# Altium project ORCS4.PrjPcb
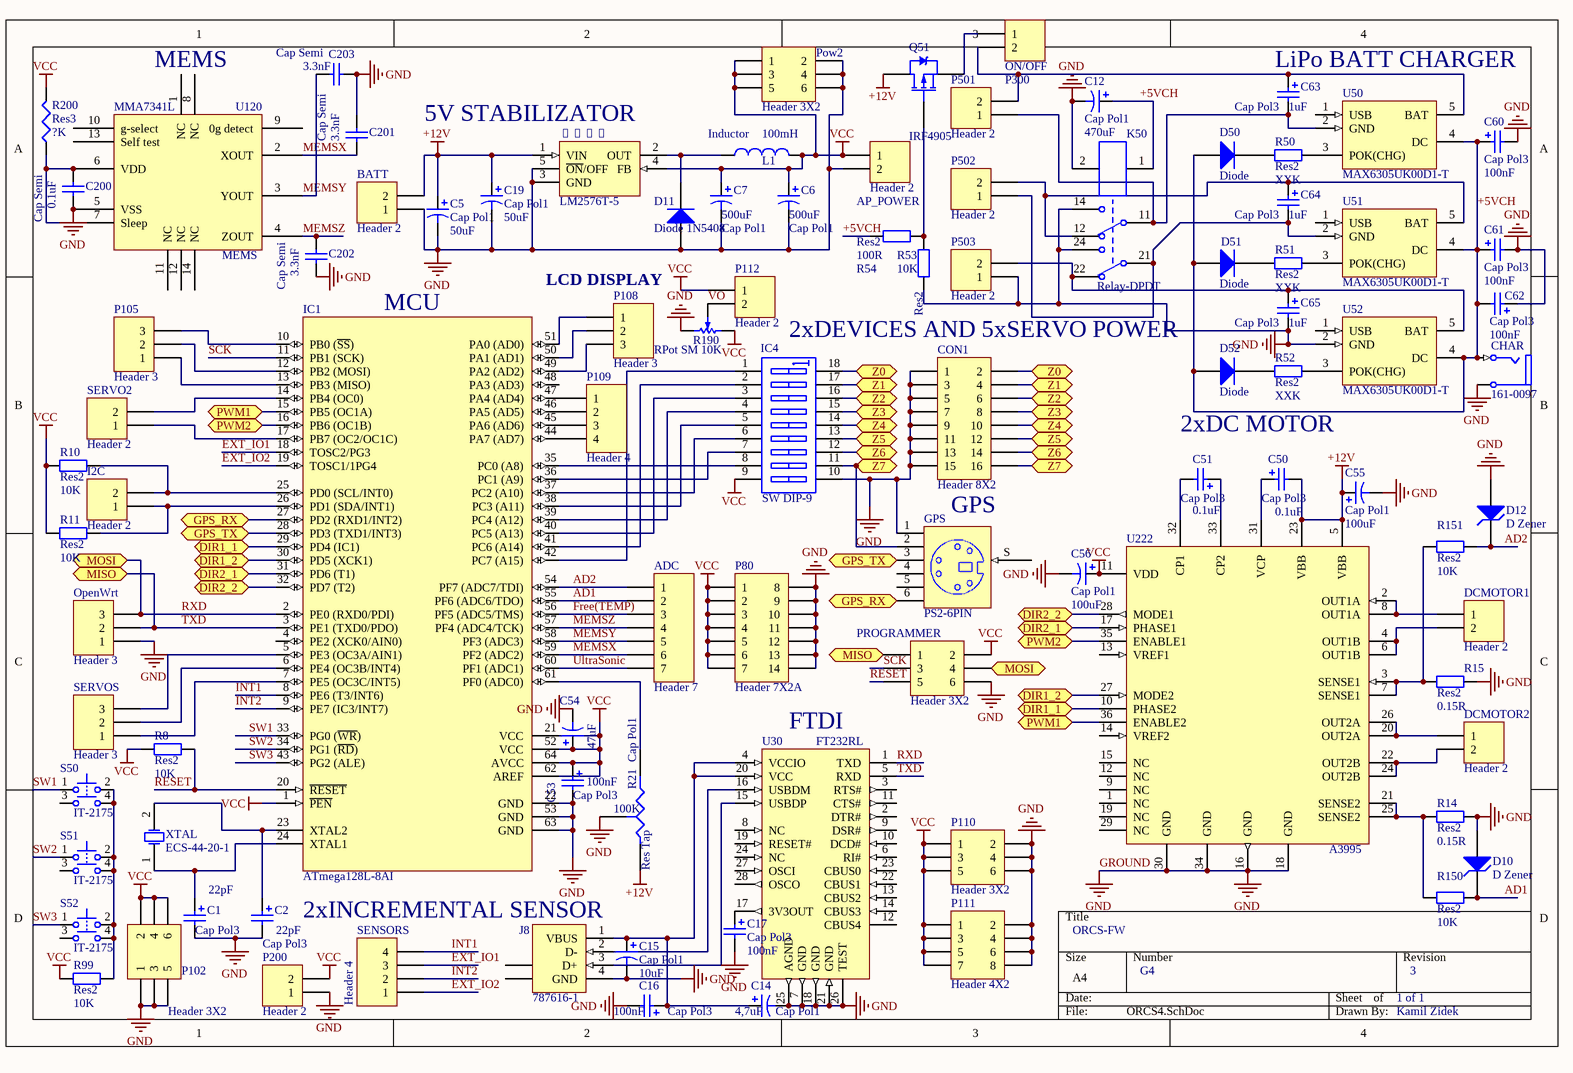
[diagram p0: ORCS4.SchDoc]
1 sheet, 94 parts. Net scope: flat (ports and power ports of the same name join across sheets).
Board file: ORCS4.PcbDoc

## Sheet ORCS4.SchDoc
size A4

### Parts
ADC  Header 7  [HDR1X7]
AP_POWER  Header 2  [HDR1X2]
BATT  Header 2  [HDR1X2]
C1  Cap Pol3  value 22pF  [C0805]
C2  Cap Pol3  value 22pF  [C0805]
C5  Cap Pol1  value 50uF  [B]
C6  Cap Pol1  value 500uF  [B]
C7  Cap Pol1  value 500uF  [B]
C12  Cap Pol1  value 470uF  [B]
C14  Cap Pol1  value 4,7uF  [B]
C15  Cap Pol1  value 10uF  [B]
C16  Cap Pol3  value 100nF  [C0805]
C17  Cap Pol3  value 100nF  [C0805]
C19  Cap Pol1  value 50uF  [B]
C50  Cap Pol3  value 0.1uF  [C0805]
C51  Cap Pol3  value 0.1uF  [C0805]
C53  Cap Pol3  value 100nF  [C0805]
C54  Cap Pol1  value 47uF  [B]
C55  Cap Pol1  value 100uF  [B]
C56  Cap Pol1  value 100uF  [B]
C60  Cap Pol3  value 100nF  [C0805]
C61  Cap Pol3  value 100nF  [C0805]
C62  Cap Pol3  value 100nF  [C0805]
C63  Cap Pol3  value 1uF  [C1206]
C64  Cap Pol3  value 1uF  [C1206]
C65  Cap Pol3  value 1uF  [C1206]
C200  Cap Semi  value 0.1uF  [CAPC3216L]
C201  Cap Semi  value 3.3nF  [CAPC3216L]
C202  Cap Semi  value 3.3nF  [CAPC3216L]
C203  Cap Semi  value 3.3nF  [CAPC3216L]
CHAR  161-0097  [161]
CON1  Header 8X2  [HDR2X8]
D10  D Zener  [CAPC2512L]
D11  Diode 1N5408  [DIODE_SMC]
D12  D Zener  [CAPC2512L]
D50  Diode  [HDR1X2]
D51  Diode  [HDR1X2]
D52  Diode  [HDR1X2]
DCMOTOR1  Header 2  [HDR1X2]
DCMOTOR2  Header 2  [HDR1X2]
GPS  PS2-6PIN  [PS2-6PIN]
I2C  Header 2  [HDR1X2]
IC1  ATmega128L-8AI  [64A_M]
IC4  SW DIP-9  [DIP-18]
IC�5  LM2576T-5  [314D-03]
J8  787616-1  [787616]
K50  Relay-DPDT  [DIP-P8]
L1  Inductor  value 100mH  [PIN-W2/E2.8]
OpenWrt  Header 3  [HDR1X3]
P80  Header 7X2A  [HDR2X7_CEN]
P102  Header 3X2  [HDR2X3]
P105  Header 3  [HDR1X3]
P108  Header 3  [HDR1X3]
P109  Header 4  [HDR1X4]
P110  Header 3X2  [HDR2X3]
P111  Header 4X2  [HDR2X4]
P112  Header 2  [HDR1X2]
P200  Header 2  [HDR1X2]
P300  ON/OFF  [HDR1X2]
P501  Header 2  [HDR1X2]
P502  Header 2  [HDR1X2]
P503  Header 2  [HDR1X2]
Pow2  Header 3X2  [HDR2X3]
PROGRAMMER  Header 3X2  [HDR2X3]
Q51  IRF4905  [TO-220AB]
R8  Res2  value 10K  [2012[0805]]
R10  Res2  value 10K  [2012[0805]]
R11  Res2  value 10K  [2012[0805]]
R14  Res2  value 0.15R  [RESC3225L]
R15  Res2  value 0.15R  [RESC3225L]
R21  Res Tap  value 100K  [VR5]
R50  Res2  value XXK  [2012[0805]]
R51  Res2  value XXK  [2012[0805]]
R52  Res2  value XXK  [2012[0805]]
R53  Res2  value 10K  [2012[0805]]
R54  Res2  value 100R  [2012[0805]]
R99  Res2  value 10K  [C0805]
R150  Res2  value 10K  [CAPC2012L]
R151  Res2  value 10K  [CAPC2012L]
R190  RPot SM 10K  [POT4MM-2]
R200  Res3  value ?K  [RESC1608L]
S50  IT-2175  [IT-2175]
S51  IT-2175  [IT-2175]
S52  IT-2175  [IT-2175]
SENSORS  Header 4  [HDR1X4]
SERVO2  Header 2  [HDR1X2]
SERVOS  Header 3  [HDR1X3]
U30  FT232RL  [SSOP28]
U50  MAX6305UK00D1-T  [SOT23-5]
U51  MAX6305UK00D1-T  [SOT23-5]
U52  MAX6305UK00D1-T  [SOT23-5]
U120  MEMS  [LGA14 - duplicate]
U222  A3995  [QFN50P600X600-36V1M]
XTAL  ECS-44-20-1  [HC-49U]

### Ports
DIR1_1, DIR1_2, DIR2_1, DIR2_2, GPS_RX, GPS_RX (bidir), GPS_TX, GPS_TX (bidir), MISO, MOSI, PWM1, PWM2, Z0, Z1, Z2, Z3, Z4, Z5, Z6, Z7

### Nets
+12V: BATT.2 C5.1 C19.1 C50.2 C55.1 IC�5.1(VIN) Q51.2(D) R21.1(A) U222.5(VBB) U222.23(VBB)
GROUND: AP_POWER.2 BATT.1 C1.2 C2.2 C5.2 C6.2 C7.2 C12.2 C14.2 C15.2 C16.2 C17.2 C19.2 C53.2 C54.2 C55.2 C56.2 C60.2 C61.2 C62.1 C65.2 C200.1 C201.2 C202.1 C203.1 CHAR.1A(Ground) CON1.1 CON1.3 CON1.5 CON1.7 CON1.9 CON1.11 CON1.13 CON1.15 D10.1(A) D11.1(A) D12.1(A) GPS.1 IC1.22(GND) IC1.53(GND) IC1.63(GND) IC4.10(B9) IC�5.3(GND) IC�5.5(~{ON}/OFF) J8.4(GND) K50.2 K50.14 K50.24 OpenWrt.1 P80.8 P80.9 P80.10 P80.11 P80.12 P80.13 P80.14 P102.1 P102.3 P102.5 P110.2 P110.4 P110.6 P111.2 P111.4 P111.6 P111.8 P200.1 P503.1 Pow2.2 Pow2.4 Pow2.6 PROGRAMMER.6 R14.1 R15.1 R21.3(TAP) R53.2 R190.CW(+) U30.7(GND) U30.18(GND) U30.21(GND) U30.25(AGND) U30.26(TEST) U52.2(GND) U120.5(VSS) U222.16(GND) U222.18(GND) U222.30(GND) U222.34(GND)  [also labelled GND]
VCC: AP_POWER.1 C6.1 C7.1 C53.1 C54.1 C56.1 IC1.1(~{PEN}) IC1.21(VCC) IC1.52(VCC) IC1.62(AREF) IC1.64(AVCC) IC4.9(A9) IC�5.4(FB) L1.2 P80.1 P80.2 P80.3 P80.4 P80.5 P80.6 P80.7 P102.2 P102.4 P102.6 P110.1 P110.3 P110.5 P111.1 P111.3 P111.5 P111.7 P112.1 P200.2 Pow2.1 Pow2.3 Pow2.5 PROGRAMMER.2 R8.1 R10.1 R11.1 R99.1 R190.CCW(-) R200.2 U222.11(VDD)
+5VCH: C12.1 C60.1 C61.1 C62.2 CHAR.2B(Signal) D50.1(A) D51.1(A) D52.1(A) K50.1 R54.1 U50.4(DC) U51.4(DC) U52.4(DC)
AD1: ADC.2 D10.2(K) IC1.55(PF6_(ADC6/TDO)) R150.1
AD2: ADC.1 D12.2(K) IC1.54(PF7_(ADC7/TDI)) R151.1
EXT_IO1: IC1.18(TOSC2/PG3) SENSORS.3
EXT_IO2: IC1.19(TOSC1/1PG4) SENSORS.1
Free(TEMP): ADC.3 IC1.56(PF5_(ADC5/TMS))
INT1: IC1.8(PE6_(T3/INT6)) SENSORS.4
INT2: IC1.9(PE7_(IC3/INT7)) SENSORS.2
MEMSX: ADC.6 C201.1 IC1.59(PF2_(ADC2)) U120.2(XOUT)
MEMSY: ADC.5 C203.2 IC1.58(PF3_(ADC3)) U120.3(YOUT)
MEMSZ: ADC.4 C202.2 IC1.57(PF4_(ADC4/TCK)) U120.4(ZOUT)
RESET: IC1.20(~{RESET}) PROGRAMMER.5 R8.2
RXD: IC1.2(PE0_(RXD0/PDI)) OpenWrt.3 PROGRAMMER.4 U30.1(TXD) ; port MOSI
SCK: IC1.11(PB1_(SCK)) PROGRAMMER.3
SW1: IC1.33(PG0_(~{WR})) S50.1
SW2: IC1.34(PG1_(~{RD})) S51.1
SW3: IC1.43(PG2_(ALE)) S52.1
TXD: IC1.3(PE1_(TXD0/PDO)) OpenWrt.2 PROGRAMMER.1 U30.5(RXD) ; port MISO
UltraSonic: ADC.7 IC1.60(PF1_(ADC1))
VO: P112.2 R190.W
NetC1_1: C1.1 IC1.24(XTAL1) XTAL.1(OSC1)
NetC2_1: C2.1 IC1.23(XTAL2) XTAL.2(OSC2)
NetC14_1: C14.1 C15.1 C16.1 J8.1(VBUS) U30.4(VCCIO) U30.20(VCC)
NetC17_1: C17.1 U30.17(3V3OUT)
NetC50_1: C50.1 U222.31(VCP)
NetC51_1: C51.1 U222.33(CP2)
NetC51_2: C51.2 U222.32(CP1)
NetC63_1: C63.1 P300.2 P501.2 U50.5(BAT)
NetC63_2: C63.2 K50.11 P501.1 U50.2(GND)
NetC64_1: C64.1 K50.12 P502.2 U51.5(BAT)
NetC64_2: C64.2 K50.21 P502.1 U51.2(GND)
NetC65_1: C65.1 K50.22 P503.2 U52.5(BAT)
NetC200_2: C200.2 R200.1 U120.6(VDD) U120.7(Sleep)
NetCON1_2: CON1.2 IC4.18(B1) ; port Z0
NetCON1_4: CON1.4 IC4.17(B2) ; port Z1
NetCON1_6: CON1.6 IC4.16(B3) ; port Z2
NetCON1_8: CON1.8 IC4.15(B4) ; port Z3
NetCON1_10: CON1.10 IC4.14(B5) ; port Z4
NetCON1_12: CON1.12 IC4.13(B6) ; port Z5
NetCON1_14: CON1.14 IC4.12(B7) ; port Z6
NetCON1_16: CON1.16 GPS.2 IC4.11(B8) ; port Z7
NetD11_2: D11.2(K) IC�5.2(OUT) L1.1
NetD50_2: D50.2(K) R50.2
NetD51_2: D51.2(K) R51.2
NetD52_2: D52.2(K) R52.2
NetDCMOTOR1_1: DCMOTOR1.1 U222.2(OUT1A) U222.8(OUT1A)
NetDCMOTOR1_2: DCMOTOR1.2 U222.4(OUT1B) U222.6(OUT1B)
NetDCMOTOR2_1: DCMOTOR2.1 U222.20(OUT2A) U222.26(OUT2A)
NetDCMOTOR2_2: DCMOTOR2.2 U222.22(OUT2B) U222.24(OUT2B)
NetGPS_3: GPS.3 IC1.28(PD3_(TXD1/INT3)) ; port GPS_TX
NetGPS_6: GPS.6 IC1.27(PD2_(RXD1/INT2)) ; port GPS_RX
NetI2C_1: I2C.1 IC1.26(PD1_(SDA/INT1)) R11.2
NetI2C_2: I2C.2 IC1.25(PD0_(SCL/INT0)) R10.2
NetIC1_5: IC1.5(PE3_(OC3A/AIN1)) SERVOS.3
NetIC1_6: IC1.6(PE4_(OC3B/INT4)) SERVOS.2
NetIC1_7: IC1.7(PE5_(OC3C/INT5)) SERVOS.1
NetIC1_10: IC1.10(PB0_(~{SS})) P105.3
NetIC1_12: IC1.12(PB2_(MOSI)) P105.2
NetIC1_13: IC1.13(PB3_(MISO)) P105.1
NetIC1_14: IC1.14(PB4_(OC0)) SERVO2.2
NetIC1_15: IC1.15(PB5_(OC1A)) U222.36(ENABLE2) ; port PWM1
NetIC1_16: IC1.16(PB6_(OC1B)) U222.35(ENABLE1) ; port PWM2
NetIC1_17: IC1.17(PB7_(OC2/OC1C)) SERVO2.1
NetIC1_29: IC1.29(PD4_(IC1)) U222.10(PHASE2) ; port DIR1_1
NetIC1_30: IC1.30(PD5_(XCK1)) U222.27(MODE2) ; port DIR1_2
NetIC1_31: IC1.31(PD6_(T1)) U222.17(PHASE1) ; port DIR2_1
NetIC1_32: IC1.32(PD7_(T2)) U222.28(MODE1) ; port DIR2_2
NetIC1_35: IC1.35(PC0_(A8)) IC4.8(A8)
NetIC1_36: IC1.36(PC1_(A9)) IC4.7(A7)
NetIC1_37: IC1.37(PC2_(A10)) IC4.6(A6)
NetIC1_38: IC1.38(PC3_(A11)) IC4.5(A5)
NetIC1_39: IC1.39(PC4_(A12)) IC4.4(A4)
NetIC1_40: IC1.40(PC5_(A13)) IC4.3(A3)
NetIC1_41: IC1.41(PC6_(A14)) IC4.2(A2)
NetIC1_42: IC1.42(PC7_(A15)) IC4.1(A1)
NetIC1_44: IC1.44(PA7_(AD7)) P109.4
NetIC1_45: IC1.45(PA6_(AD6)) P109.3
NetIC1_46: IC1.46(PA5_(AD5)) P109.2
NetIC1_47: IC1.47(PA4_(AD4)) P109.1
NetIC1_49: IC1.49(PA2_(AD2)) P108.3
NetIC1_50: IC1.50(PA1_(AD1)) P108.2
NetIC1_51: IC1.51(PA0_(AD0)) P108.1
NetIC1_61: IC1.61(PF0_(ADC0)) R21.2(B)
NetJ8_2: J8.2(D-) U30.16(USBDM)
NetJ8_3: J8.3(D+) U30.15(USBDP)
NetP300_1: P300.1 Q51.3(S)
NetQ51_1: Q51.1(G) R53.1 R54.2
NetR14_2: R14.2 R150.2 U222.21(SENSE2) U222.25(SENSE2)
NetR15_2: R15.2 R151.2 U222.3(SENSE1) U222.7(SENSE1)
NetR50_1: R50.1 U50.3(POK(CHG))
NetR51_1: R51.1 U51.3(POK(CHG))
NetR52_1: R52.1 U52.3(POK(CHG))
NetR99_2: R99.2 S50.2 S50.4 S51.2 S51.4 S52.2 S52.4

Not connected (* = marked no-connect by the designer): GPS 4 5 S; IC1 4(PE2_(XCK0/AIN0)) 48(PA3_(AD3)); J8 5(SHLD) 6(SHLD); S50 3; S51 3; S52 3; U30 2(DTR#) 3(RTS#) 6(RI#) 8(NC) 9(DSR#) 10(DCD#) 11(CTS#) 12(CBUS4) 13(CBUS2) 14(CBUS3) 19(RESET#) 22(CBUS1) 23(CBUS0) 24(NC) 27(OSCI) 28(OSCO); U50 1(USB); U51 1(USB); U52 1(USB); U120 1(NC) 8(NC) 9(0g_detect) 10(g-select) 11(NC) 12(NC) 13(Self_test) 14(NC); U222 1(NC) 9(NC) 12(NC) 13(VREF1) 14(VREF2) 15(NC) 19(NC) 29(NC)

### Notes on the sheet
- (near U120) MEMS
- (near IC�5) 5V STABILIZATOR
- (near C63) LiPo BATT CHARGER
- (near IC1) MCU
- (near P108) LCD DISPLAY
- 2xDEVICES AND 5xSERVO POWER
- 2xDC MOTOR
- (near GPS) GPS
- FTDI
- (near J8) 2xINCREMENTAL SENSOR
- ORCS-FW
- G4
- 1 of 1
- 3
- Kamil Zidek
- (in symbol MMA7341) MMA7341L

### Library data of the parts
ADC = Header 7: Header, 7-Pin; LatestRevisionDate: 17-Jul-2002; LatestRevisionNote: Re-released for DXP Platform.; Publisher: Altium Limited
AP_POWER BATT DCMOTOR1 DCMOTOR2 I2C P112 P200 P300 P501-P503 SERVO2 = Header 2: Header, 2-Pin; LatestRevisionDate: 17-Jul-2002; LatestRevisionNote: Re-released for DXP Platform.; Publisher: Altium Limited
C1 C2 C16 C17 C50 C51 C53 C60-C65 = Cap Pol3: Polarized Capacitor (Surface Mount); Published: 8-Jun-2000; LatestRevisionDate: 17-Jul-2002; LatestRevisionNote: Re-released for DXP Platform.; PackageReference: C0805; Publisher: Altium Limited
C5-C7 C12 C14 C15 C19 C54-C56 = Cap Pol1: Polarized Capacitor (Radial); Published: 8-Jun-2000; LatestRevisionDate: 17-Jul-2002; LatestRevisionNote: Re-released for DXP Platform.; PackageReference: RB7.6-15; Publisher: Altium Limited
C200-C203 = Cap Semi: Capacitor (Semiconductor SIM Model); Published: 8-Jun-2000; LatestRevisionDate: 29-May-2009; LatestRevisionNote: IPC-7351 Footprint Added.; PackageReference: C1206; Publisher: Altium Limited; PackageDescription: Chip Capacitor
CHAR = 161-0097: RCA Phono Jack, Right Angle, Thru-Hole, Snap-In, Black; PCB_Layout: Complies with manufacturer's recommendation.; DrillAndSlotSize: Corresponds to nominal value.; Published: 15-Jul-2004; DatasheetDocument: 7-Jul-2000; PackageDocument: 7-Jul-2000; PackageReference: 161; Publisher: Altium Limited; ComponentLink1Description: Manufacturer Link; ComponentLink1URL: http://www.mouser.com/kobiconn/; ComponentLink2Description: Datasheet; ComponentLink2URL: http://www.mouser.com/catalog/specsheets/KC-300562.pdf
CON1 = Header 8X2: Header, 8-Pin, Dual row; LatestRevisionDate: 17-Jul-2002; LatestRevisionNote: Re-released for DXP Platform.; Publisher: Altium Limited
D10 D12 = D Zener: Zener Diode; Published: 8-Jun-2000; LatestRevisionDate: 17-Jul-2002; LatestRevisionNote: Re-released for DXP Platform.; PackageReference: DIODE-0.7; Publisher: Altium Limited
D11 = Diode 1N5408: 3 Amp Medium Power Silicon Rectifier Diode; Published: 8-Jun-2000; LatestRevisionDate: 17-Jul-2002; LatestRevisionNote: Re-released for DXP Platform.; DatasheetDocument: Aug-1984; PackageReference: DO-201AD; Publisher: Altium Limited; ComponentLink1Description: Manufacturer Link; ComponentLink1URL: http://www.irf.com/
D50-D52 = Diode: Default Diode; Published: 8-Jun-2000; LatestRevisionDate: 17-Jul-2002; LatestRevisionNote: Re-released for DXP Platform.; PackageDocument: Sep-1996; PackageReference: SMC; Publisher: Altium Limited; Code_JEDEC: DO-214-AB
GPS = PS2-6PIN: 6 Pin Through Hole PS2 Socket (Kycon P/N); Published: 17-Dec-2003; Publisher: Altium Limited; ComponentLink1Description: Manufacturer Link; ComponentLink1URL: http://www.oupiin.com/prodindx.html#Headers
IC1 = ATmega128L-8AI: 8-Bit AVR Microcontroller with 128K Bytes of In-System Programmable Flash Memory; Published: 17-Sep-2003; LatestRevisionDate: 13-Apr-2006; LatestRevisionNote: IPC-7351 Footprint Added.; DatasheetVersion: 2467G-AVR-09/02; PackageVersion: revB, Oct-2001; PackageReference: 64A; Publisher: Altium Limited; PackageDescription: 64-Pin Thin Quad Flat Pack 0.8 mm Pitch; Code_JEDEC: MS-026-AEB; ComponentLink1Description: Manufacturer Link; ComponentLink1URL: http://www.atmel.com; ComponentLink2Description: Datasheet; ComponentLink2URL: http://www.atmel.com/dyn/resources/prod_documents/doc2467.pdf
IC4 = SW DIP-9: DIP Switch, 9 Position, SPST; Published: 24-Mar-1999; LatestRevisionDate: 17-Jul-2002; LatestRevisionNote: Re-released for DXP Platform.; PackageReference: DIP-18; Publisher: Altium Limited; Code_JEDEC: MO-036-AE
IC�5 = LM2576T-5: Easy Switcher 3.0A Step-Down Voltage Regulator; Published: 15-Apr-2002; DatasheetVersion: Jul-1999; PackageVersion: Jul-1999; PackageReference: 314D-03; Publisher: Altium Limited; PackageDescription: TO, Thru-Hole, Vertical, Heatsink Mounted; 5 In-Line Leads; Pitch 1.70 mm; Code_JEDEC: TS-001-AA; ComponentLink1Description: Manufacturer Link; ComponentLink1URL: http://www.onsemi.com/site/products/taxonomy/0,4438,503,00.html; ComponentLink2Description: Datasheet; ComponentLink2URL: http://www.onsemi.com/pub/Collateral/LM2576-D.PDF
J8 = 787616-1: USB 1.1, Right Angle, Thru-Hole, A Type, Receptacle, 4 Position, Black; Note: Directive 2000/53/EC (ELV) Compliant; ContactMaterial: Copper Alloy; ContactPlating: Gold (30) over Palladium Nickel; TerminationLength: 2.84mm [0.112in.]; PCB_Layout: Complies with manufacturer's recommendation.; DrillSize: Corresponds to nominal value.; PanelGround: Without; Published: 15-Jul-2004; DatasheetDocument: 11-Jan-2004; PackageDocument: 11-Jan-2004; PackageReference: 787616; Publisher: Altium Limited; HousingMaterial: Thermoplastic; ComponentLink1Description: Manufacturer Link; ComponentLink1URL: http://www.tycoelectronics.com/; ComponentLink2Description: Packaging Specification; ComponentLink2URL: http://ecommas.tycoelectronics.com/commerce/DocumentDelivery/DDEController?Action=showdoc&DocId=Customer+Drawing%7F787616%7FK%7Fpdf%7FEnglish%7FENG_CD_787616_K.pdf
K50 = Relay-DPDT: Dual-Pole Dual-Throw Relay; Published: 24-Mar-1999; LatestRevisionDate: 17-Jul-2002; LatestRevisionNote: Re-released for DXP Platform.; PackageReference: DIP-P8; Publisher: Altium Limited
L1 = Inductor: Code_IEC: 1005; Published: 8-Jun-2000; LatestRevisionDate: 17-Jul-2002; LatestRevisionNote: Re-released for DXP Platform.; PackageReference: 0402-A; Publisher: Altium Limited; Code_JEITA: 0402
OpenWrt P105 P108 SERVOS = Header 3: Header, 3-Pin; LatestRevisionDate: 17-Jul-2002; LatestRevisionNote: Re-released for DXP Platform.; Publisher: Altium Limited
P80 = Header 7X2A: Header, 7-Pin, Dual row; LatestRevisionDate: 17-Jul-2002; LatestRevisionNote: Re-released for DXP Platform.; Publisher: Altium Limited
P102 P110 Pow2 PROGRAMMER = Header 3X2: Header, 3-Pin, Dual row; LatestRevisionDate: 17-Jul-2002; LatestRevisionNote: Re-released for DXP Platform.; Publisher: Altium Limited
P109 SENSORS = Header 4: Header, 4-Pin; LatestRevisionDate: 17-Jul-2002; LatestRevisionNote: Re-released for DXP Platform.; Publisher: Altium Limited
P111 = Header 4X2: Header, 4-Pin, Dual row; LatestRevisionDate: 17-Jul-2002; LatestRevisionNote: Re-released for DXP Platform.; Publisher: Altium Limited
Q51 = IRF4905: HEXFET Power MOSFET; Note: Pin 2 is electrically connected to pin 4.; Published: 8-Jun-2000; LatestRevisionDate: 17-Jul-2002; LatestRevisionNote: Re-released for DXP Platform.; DatasheetVersion: Aug-1997; PackageVersion: Feb-1997; PackageReference: TO-220AB; Publisher: Altium Limited; PackageDescription: TO, Thru-Hole, Vertical, Heatsink Mounted; 3 In-Line Leads; Pitch 2.54 mm; ComponentLink1Description: Manufacturer Link; ComponentLink1URL: http://www.irf.com/; ComponentLink2Description: Datasheet; ComponentLink2URL: http://www.irf.com/product-info/datasheets/data/irf4905.pdf
R8 R10 R11 R14 R15 R50-R54 R99 R150 R151 = Res2: Resistor; Published: 8-Jun-2000; LatestRevisionDate: 17-Jul-2002; LatestRevisionNote: Re-released for DXP Platform.; PackageReference: AXIAL-0.4; Publisher: Altium Limited
R21 = Res Tap: Tapped Resistor; Sim Note: Enter the Resistance value and the set point into parameter fields.; Set Position: 0.5; Published: 24-Mar-1999; LatestRevisionDate: 17-Jul-2002; LatestRevisionNote: Re-released for DXP Platform.; PackageReference: VR3; Publisher: Altium Limited
R190 = RPot SM: Square Trimming Potentiometer; Published: 17-Dec-2003; DatasheetDocument: Oct-2003; PackageReference: POT4MM-2; Publisher: Altium Limited; ComponentLink1Description: Manufacturer Link; ComponentLink1URL: http://bourns.com/2/search.html
R200 = Res3: Resistor; Published: 8-Jun-2000; LatestRevisionDate: 29-May-2009; LatestRevisionNote: IPC-7351 Footprint Added.; PackageReference: J1-0603; Publisher: Altium Limited; PackageDescription: Chip Resistor
S50-S52 = IT-2175: Tactile Switch, DPST; Thru-Hole; Vertical; Rating DC 12V, 50mA (max); PackageDocument: Rev.0; Published: 6-Jun-2005; DatasheetDocument: Rev.0; PackageReference: IT-2175; Publisher: Altium Limited; ComponentLink1Description: Manufacturer Link; ComponentLink1URL: http://www.ilswitch.com/; ComponentLink2Description: Device Overview; ComponentLink2URL: http://www.ilswitch.com/list.php?ac_id=010112&ai_id=91
U30 = DS211E: 4 Driver/5 Receiver RS-232 Serial Port; Published: 13-Oct-2000; LatestRevisionDate: 06-Jun-2005; LatestRevisionNote: Stylized 3D Model Added.; DatasheetVersion: 15-Mar-1995; PackageVersion: Feb-1999; PackageReference: SSOP28; Publisher: Altium Limited; PackageDescription: SSOP, Plastic; 28 Leads; Body Width 5.3 mm; Pitch 0.65 mm; Code_JEDEC: MO-150-AH; ComponentLink1Description: Manufacturer Link; ComponentLink1URL: http://www.maxim-ic.com/
U50-U52 = MAX6305UK00D1-T: 5-Pin, Multiple-Input, Programmable Reset IC; Published: 16-Jan-2001; LatestRevisionDate: 17-Jul-2002; LatestRevisionNote: Re-released for DXP Platform.; DatasheetVersion: Aug-1998; PackageReference: SOT23-5; Publisher: Altium Limited; PackageDescription: SOT-23/SC-74A; 5 Leads; Body 3 x 3 mm, inc. leads (LxW max); ComponentLink1Description: Manufacturer Link; ComponentLink1URL: http://www.maxim-ic.com/; ComponentLink2Description: Datasheet; ComponentLink2URL: http://pdfserv.maxim-ic.com/en/ds/MAX6305-MAX6313.pdf
U120 = MMA7341: MMA7341: *
U222 = A3995: Full-Bridge PWM Motor Driver; Note: Pins 5-11 and 19-25 are connected; ComponentAvailability: Obsolete; Published: 13-Oct-2000; LatestRevisionDate: 13-Apr-2006; LatestRevisionNote: IPC-7351 Footprint Added.; DatasheetVersion: 1994; PackageVersion: 1994; PackageReference: EB28; Publisher: Altium Limited; PackageDescription: 36-Pin Leaded Chip Carrier 1.27 mm Pitch; Code_IPC: QFN-36; ComponentLink1Description: Manufacturer Link; ComponentLink1URL: http://www.allegromicro.com/; ComponentLink2Description: Datasheet; ComponentLink2URL: http://www.allegromicro.com/datafile/archive/3952.pdf; ComponentLink3Description: Discontinuation Notice; ComponentLink3URL: http://www.allegromicro.com/techpub2/3952_3959_app_note/
XTAL = ECS-44-20-1: Crystal Oscillator; Published: 17-Jul-2002; DatasheetDocument: 18-Apr-2000; PackageReference: HC-49U; Publisher: Altium Limited; ComponentLink1Description: Manufacturer Link; ComponentLink1URL: http://www.ecsxtal.com/; ComponentLink2Description: Datasheet; ComponentLink2URL: http://www.ecsxtal.com/pdf2/HC49U.PDF

## Assembly variants
ORCS_1Layer: all parts fitted
Variant of ORCS4: all parts fitted